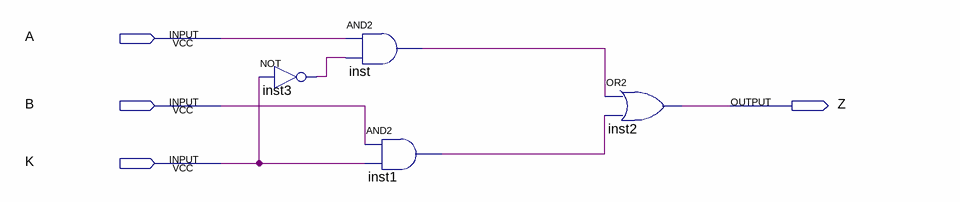
[diagram p0: schematic sheet]
// Quartus schematic two_mux.bdf as structural Verilog: 4 symbols, 4 pins
module two_mux (
  input  A,
  input  B,
  input  K,
  output Z
);

  wire inst1_out, inst3_out, inst_out;

  not inst3 (inst3_out, K);
  and inst (inst_out, A, inst3_out);
  and inst1 (inst1_out, B, K);
  or inst2 (Z, inst_out, inst1_out);
endmodule
